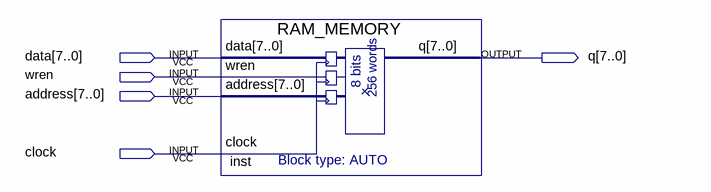
[diagram p0: schematic sheet]
// Quartus schematic RAM_MEMORY.bdf as structural Verilog: 1 symbols, 5 pins
module RAM_MEMORY (
  input  [7:0] data,
  input  wren,
  input  [7:0] address,
  input  clock,
  output [7:0] q
);

  RAM_MEMORY inst (.data(data), .wren(wren), .address(address), .clock(clock), .q(q));
endmodule
